# Altium schematic sheet CE842170047_SHEET3.SchDoc
size Tabloid; SheetNumber: 4; SheetTotal: 4; PageSetup: Record=PageOptions|CenterHorizontal=True|CenterVertical=True|PrintScale=0.70|XCorrection=1.00|YCorrection=1.00|PrintKind=1|BorderSize=5000000|LeftOffset=0|BottomOffset=0|Orientation=2|PaperLength=1000|PaperWidth=1000|Scale=100|PaperSource=7|PrintQuality=-4|MediaType=1|DitherType=10|PaperKind=8 1/2x11|PrintScaleMode=1; SPICEModelCacheMIYJXAQF: <root> / <DocumentId>MIYJXAQF</DocumentId> / </root>
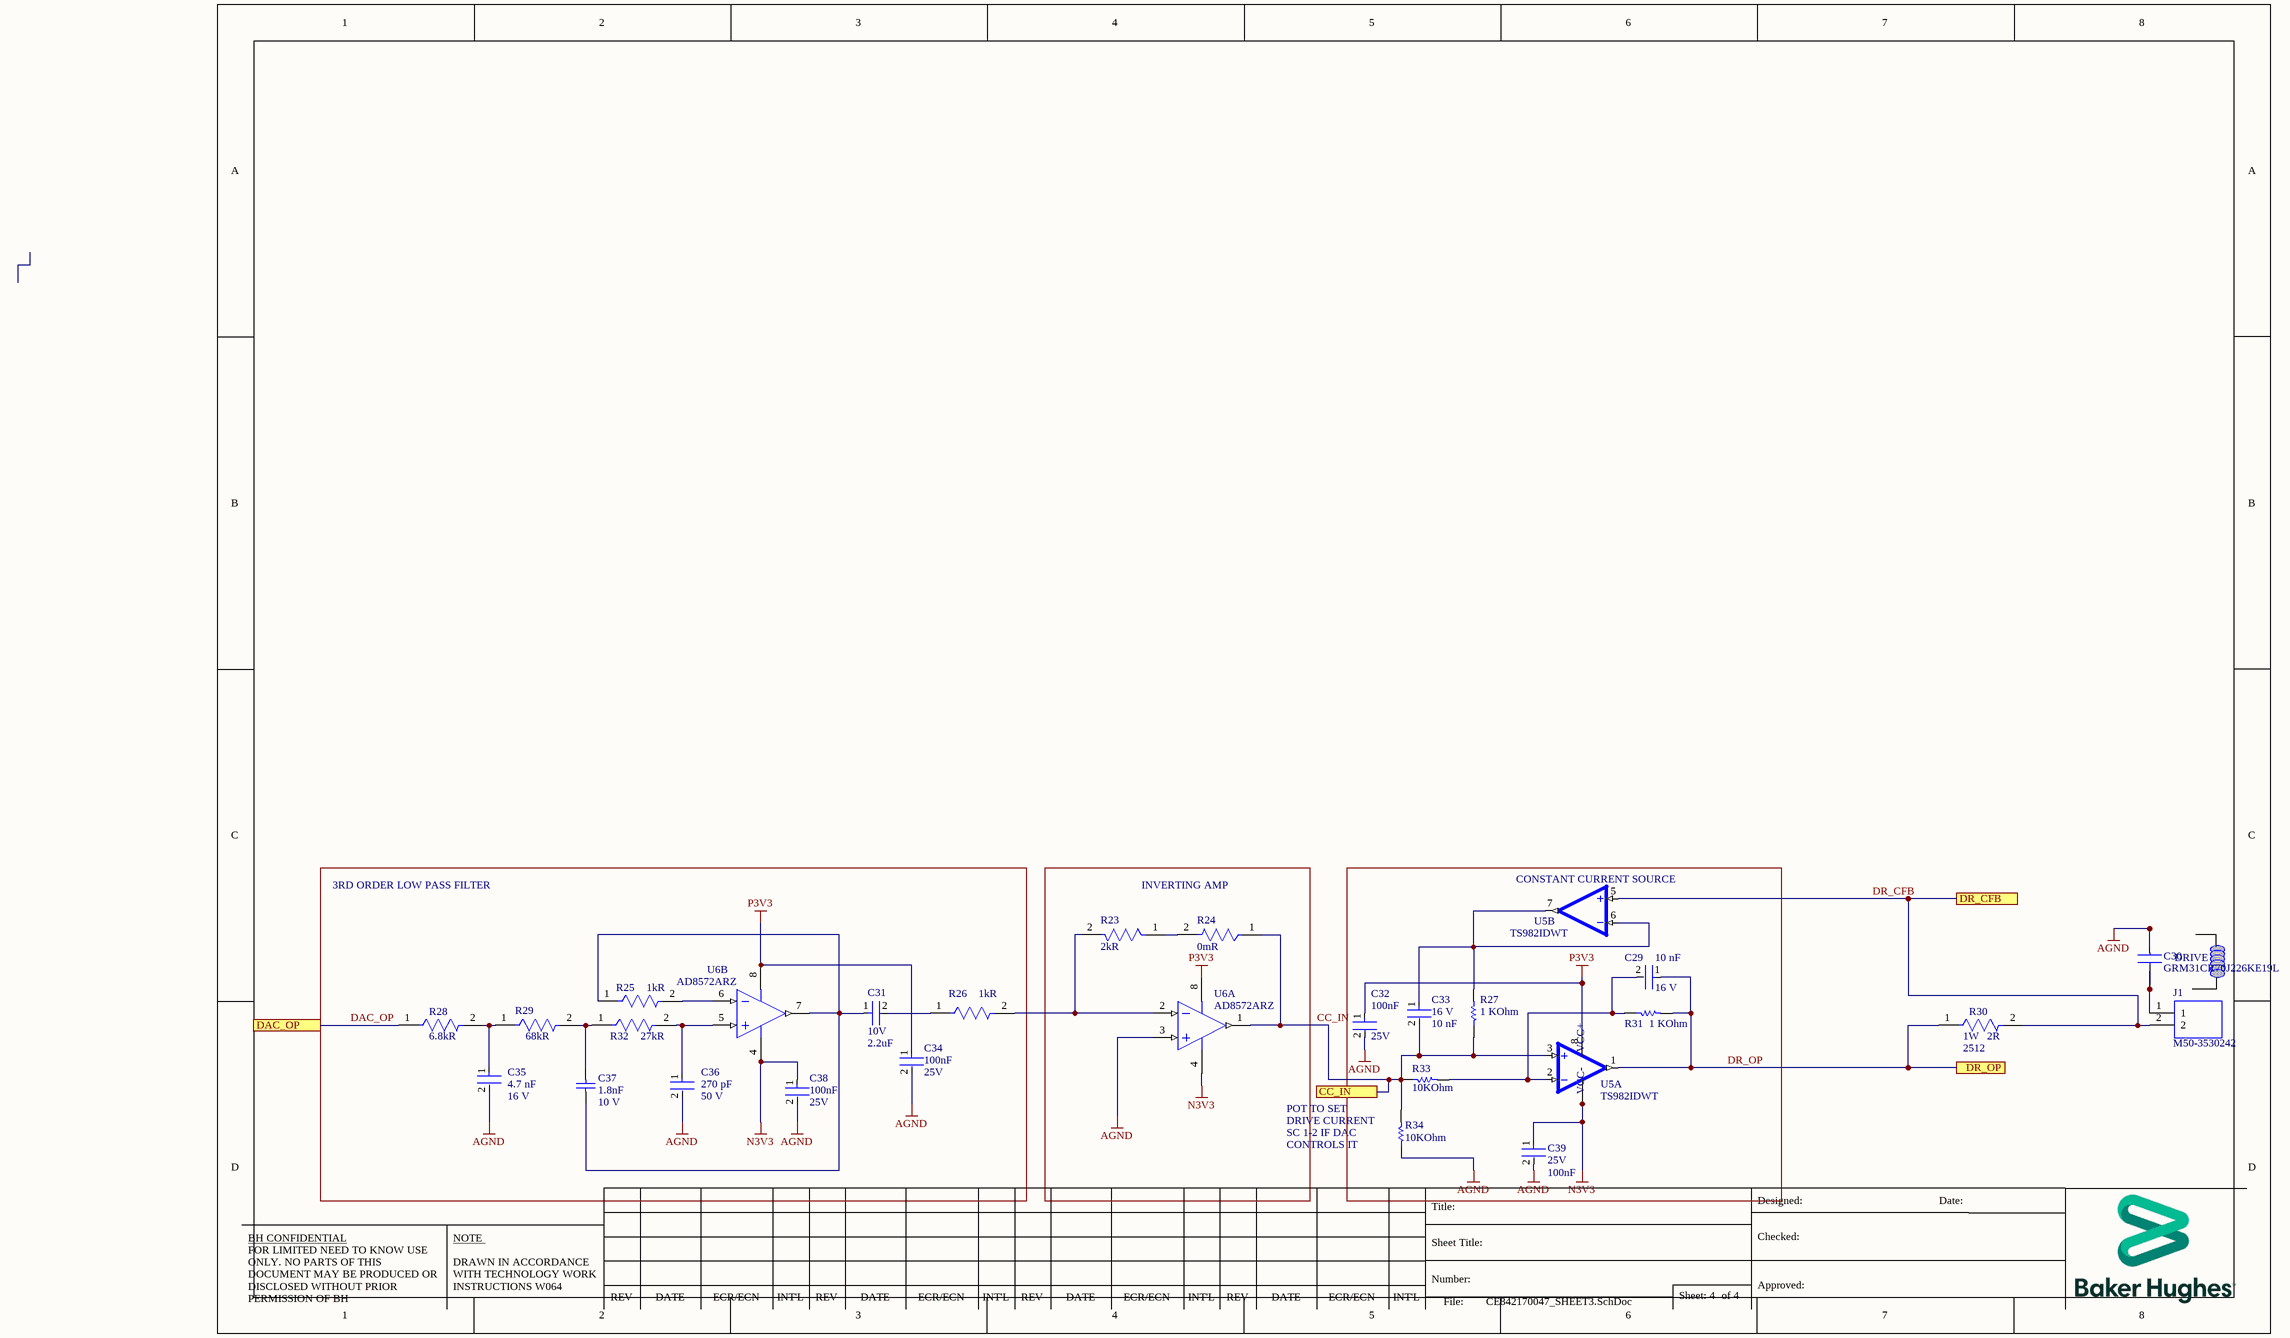
[diagram p0: CE842170047_SHEET3.SchDoc]

## Parts
C29  Capacitance: 10 nF  Voltage Rating: 16 V  [FP-CC0402-MFG]  (hidden comment: CC0402KRX7R7BB103)
C30  GRM31CR70J226KE19L  [CAPC3216X180N]
C31  Voltage Rating: 10V  Capacitance: 2.2uF  [FP-CGB3B-IPC_A]  (hidden comment: CGB3B3X5R1A225M055AB)
C32  Voltage Rating (DC): 25V  Capacitance: 100nF  [FP-C1005-050-0_05-MFG]  (hidden comment: C1005X5R1E104K050BC)
C33  Capacitance: 10 nF  Voltage Rating: 16 V  [FP-CC0402-MFG]  (hidden comment: CC0402KRX7R7BB103)
C34  Voltage Rating (DC): 25V  Capacitance: 100nF  [FP-C1005-050-0_05-MFG]  (hidden comment: C1005X5R1E104K050BC)
C35  Capacitance: 4.7 nF  Voltage Rating: 16 V  [FP-CC0402-MFG]  (hidden comment: CC0402KRX7R7BB472)
C36  Capacitance: 270 pF  Voltage Rating: 50 V  [FP-C0402-BB-MFG]  (hidden comment: C0402C271K5RACTU)
C37  value 1.8nF  Rated Voltage: 10 V  [CAPC0402(1005)60_N]  (hidden comment: CAP 1.8nF 10V 0402(1005))
C38  Voltage Rating (DC): 25V  Capacitance: 100nF  [FP-C1005-050-0_05-MFG]  (hidden comment: C1005X5R1E104K050BC)
C39  Voltage Rating (DC): 25V  Capacitance: 100nF  [FP-C1005-050-0_05-MFG]  (hidden comment: C1005X5R1E104K050BC)
J1  M50-3530242  [HDRV2W40P0X127_1X2_254X210X420P]
R23  Resistance: 2kR  [FP-CRCW0402-e3-IPC_C]  (hidden comment: CRCW04022K00FKED)
R24  Resistance: 0mR  [FP-MCS0402-MFG]  (hidden comment: MCS04020Z0000ZE000)
R25  Resistance: 1kR  [FP-CRCW0402-e3-MFG]  (hidden comment: CRCW04021K00FKED)
R26  Resistance: 1kR  [FP-CRCW0402-e3-MFG]  (hidden comment: CRCW04021K00FKED)
R27  Resistance: 1 KOhm  [RESC1005X40X25NL05T05]  (hidden comment: ERJ-2RKF1001X)
R28  Resistance: 6.8kR  [FP-ERJ2RK-IPC_B]  (hidden comment: ERJ-2RKF6801X)
R29  Resistance: 68kR  [FP-CRCW0402-e3-IPC_C]  (hidden comment: CRCW040268K0JNED)
R30  Case Code (Imperial): 2512  Resistance: 2R  Power Rating: 1W  [FP-CRCW2512-e3-IPC_A]  (hidden comment: CRCW25122R00FNEG)
R31  Resistance: 1 KOhm  [RESC1005X40X25NL05T05]  (hidden comment: ERJ-2RKF1001X)
R32  Resistance: 27kR  [FP-CRCW0402-e3-IPC_C]  (hidden comment: CRCW040227K0JNED)
R33  Resistance: 10KOhm  [RESC1005X40X25LL05T05]  (hidden comment: ERJ2RKF1002X)
R34  Resistance: 10KOhm  [RESC1005X40X25LL05T05]  (hidden comment: ERJ2RKF1002X)
U5  TS982IDWT  [SOIC127P600X175-9N]  (parts A,B of 2)
U6  AD8572ARZ  [ADI-R-8_M]  (parts A,B of 2)

## Blocks framed on the sheet
3RD ORDER LOW PASS FILTER: C31 C34-C38 R25 R26 R28 R29 R32 U6
CONSTANT CURRENT SOURCE: C29 C32 C33 C39 R27 R31 R33 R34 U5

## Ports
CC_IN, DAC_OP, DR_CFB, DR_OP

## Nets
AGND: C30.2 C32.2 C34.2 C35.2 C36.2 C38.2 C39.2 R34.1 U6.3(+IN_A)
N3V3: C38.1 C39.1 U5.4(VCC-) U5.9(VCC-) U6.4(-V)
P3V3: C32.1 C34.1 U5.8(VCC+) U6.8(+V)
CC_IN: C33.2 R24.1 R27.1 R33.1 R34.2 U5.3(NON_INVERTING_INPUT_1) U6.1(OUT_A) ; port CC_IN
DAC_OP: R28.1 ; port DAC_OP
DR_CFB: J1.2 R30.2 U5.5(NON_INVERTING_INPUT_2) ; port DR_CFB
DR_OP: C29.1 R30.1 R31.2 U5.1(OUTPUT1) ; port DR_OP
NetC29_2: C29.2 R31.1 R33.2 U5.2(INVERTING_INPUT_1)
NetC30_1: C30.1 J1.1
NetC31_1: C31.1 C37.1 R25.1 U6.7(OUT_B)
NetC31_2: C31.2 R26.1
NetC33_1: C33.1 R27.2 U5.6(INVERTING_INPUT_2) U5.7(OUTPUT2)
NetC35_1: C35.1 R28.2 R29.1
NetC36_1: C36.1 R32.2 U6.5(+IN_B)
NetC37_2: C37.2 R29.2 R32.1
NetR23_1: R23.1 R24.2
NetR23_2: R23.2 R26.2 U6.2(-IN_A)
NetR25_2: R25.2 U6.6(-IN_B)

## Notes on the sheet
- (near R23) INVERTING AMP
- (near C30) DRIVE
- POT TO SET
- DRIVE CURRENT
- SC 1-2 IF DAC
- CONTROLS IT
- BH CONFIDENTIAL
- NOTE
- Title:
- Sheet Title:
- Designed:
- Checked:
- Date:
- DRAWN IN ACCORDANCE WITH TECHNOLOGY WORK INSTRUCTIONS W064
- REV
- DATE
- ECR/ECN
- INT'L
- Number:
- Approved:
- FOR LIMITED NEED TO KNOW USE ONLY. NO PARTS OF THIS DOCUMENT MAY BE PRODUCED OR DISCLOSED WITHOUT PRIOR PERMISSION OF BH
- File:
- Sheet:
- of

## Library data of the parts
C29 C33 = CMP-03422-000501-1: CAP CER 10000PF 16V X7R 0402; Manufacturer: YAGEO; Automotive Grade: NA; Material: Ceramic; Value: 10 nF; Tolerance: 0.1; Temperature Coefficient: 30ppm/°C; Temperature Range Low: -55°C; Temperature Range High: +125°C; Mouser Description: 0402 10 nF 16 V ±10 % Tolerance X7R SMT Multilayer Ceramic Capacitor; Footprint Url: http://www.yageo.com/exep/pages/download/literatures/UPY-C_GEN_24.pdf; Category: Cap; RoHS: TRUE; Manufacturer Part Number: CC0402KRX7R7BB103; ComponentLink2Description: Datasheet; Ipc Land Pattern Name: CAPC10050X50; Automotive: No; ComponentLink2URL: http://www.yageo.com/documents/recent/UPY-GP_NP0_16V-to-50V_16.pdf; Device Class L1: Passive Components; Height: 0.55mm; Temperature Characteristic: X7R; Package: CC0402; Device Class L3: Ceramic Capacitors; Lead Free: Yes; Device Class L2: Capacitors; Digikey Description: CAP CER 10000PF 16V X7R 0402; Octopart: https://octopart.com/cc0402krx7r7bb103-yageo-192895; Temperature: -55°C to +125°C
C30 = GRM31CR70J226KE19L: Murata 1206 GRM 22uF Ceramic Multilayer Capacitor, 6.3 V dc, +125C, X7R Dielectric, +/-10% SMD; Manufacturer_Name: Murata Electronics; Geometry.Height: 1.8mm; Manufacturer_Part_Number: GRM31CR70J226KE19L; Mouser Part Number: 81-GRM31CR70J226KE9L; Mouser Price/Stock: https://www.mouser.co.uk/ProductDetail/Murata-Electronics/GRM31CR70J226KE19L?qs=WYkmdVEdyYbKPyWIkgMm5A%3D%3D; Arrow Part Number: GRM31CR70J226KE19L; Arrow Price/Stock: https://www.arrow.com/en/products/grm31cr70j226ke19l/murata-manufacturing?region=nac; Mouser Testing Part Number: *; Mouser Testing Price/Stock: *; Datasheet Link: https://datasheet.datasheetarchive.com/originals/distributors/Datasheets_SAMA/ec4f1577dddcc7a13ddad897a28002d3.pdf
C31 = CMP-08246-006382-1: Multilayer Ceramic Capacitors 2.2uF ±20% 10V X5R SMD 0603; Max Operating Temperature: 85°C; Length: 1.6mm; Case Code (Imperial): 0603; Termination: SMD/SMT; Weight: 7.1E-05oz; Mount: Surface Mount; Depth: 0.8mm; Packaging: Tape and Reel; RoHS Compliant: Yes; Series: CGB; Voltage Rating (DC): 10V; Dielectric: X5R; Case/Package: 0603; Case Code (Metric): 1608; Height: 0.55mm; Min Operating Temperature: -55°C; Thickness: 0.022inch; Tolerance: 20%; Width: 0.8mm; Package Quantity: 1; Lead Free: Lead Free
C32 C34 C38 C39 = CMP-2000-06000-2: Multilayer Ceramic Capacitors 100nF ±10% 25V X5R SMD 0402; Case Code (Imperial): 0402; Termination: Wraparound; Series: C; Depth: 0.5mm; Contact Plating: Tin; Case Code (Metric): 1005; Dielectric: X5R; Case/Package: 0402; Voltage Rating: 25V; Packaging: Tape and Reel; Thickness: 0.022inch; Dielectric Material: Ceramic; Height: 0.5mm; Weight: 2.3E-05oz; RoHS Compliant: Yes; Width: 0.02inch; Tolerance: 10%; Mount: Surface Mount; Package Quantity: 1; Max Operating Temperature: 85°C; Construction: Flat; Min Operating Temperature: -55°C; REACH SVHC: No SVHC; Resistor Type: Ceramic; Length: 1mm; Lead Free: Lead Free; Voltage: 25V
C35 = CMP-1034-01810-2: CAP CER 4700PF 16V X7R 0402; Manufacturer: YAGEO; Automotive Grade: NA; Material: Ceramic; Value: 4.7 nF; Tolerance: 0.1; Temperature Coefficient: 30ppm/°C; Automotive: No; Temperature Range Low: -55°C; Category: Cap; RoHS: TRUE; Footprint Url: http://www.yageo.com/exep/pages/download/literatures/UPY-C_GEN_24.pdf; Device Class L2: Capacitors; Octopart: https://octopart.com/cc0402krx7r7bb472-yageo-44648962; Package: CC0402; Temperature Characteristic: X7R; ComponentLink2Description: Datasheet; ComponentLink2URL: http://www.yageo.com/documents/recent/UPY-GP_NP0_16V-to-50V_16.pdf; Mouser Description: YAGEO (PHYCOMP) - CC0402KRX7R7BB472 - CAP, MLCC, X7R, 4.7NF, 16V, 0402; Device Class L1: Passive Components; Ipc Land Pattern Name: CAPC10050X50; Height: 0.55mm; Device Class L3: Ceramic Capacitors; Manufacturer Part Number: CC0402KRX7R7BB472; Temperature: -55°C to +125°C; Temperature Range High: +125°C; Lead Free: Yes; Digikey Description: CAP CER 4700PF 16V X7R 0402
C36 = CMP-2008-02191-3: CAP CER 270PF 50V 10% X7R 0402; Manufacturer: Kemet; Temperature Coefficient: 15%; Tolerance: 0.1; Material: Ceramic; Device Class L2: Capacitors; Digikey Description: CAP CER 270PF 50V 10% X7R 0402; ComponentLink2Description: Datasheet; Temperature: -55°C to +125°C; Value: 270 pF; Manufacturer Part Number: C0402C271K5RACTU; RoHS: TRUE; Automotive: No; Mouser Description: Multilayer Ceramic Capacitors MLCC - SMD/SMT 50volts 270pF X7R 10%; Category: Cap; Lead Free: Yes; Package: C0402-BB; Device Class L3: Ceramic Capacitors; Octopart: https://octopart.com/c0402c271k5ractu-kemet-5510096; Ipc Land Pattern Name: CAPC10050X50; Device Class L1: Passive Components; Height: 0.55mm; Temperature Characteristic: X7R; Temperature Range High: +125°C; Temperature Range Low: -55°C; ComponentLink2URL: https://content.kemet.com/datasheets/KEM_C1002_X7R_SMD.pdf
C37 = CMP-1034-01698-1: CAP 1.8nF 10V ±5% 0402 (1005 Metric) Thickness 0.6mm SMD; Case-Metric: 1005; Case-EIA: 0402; Tolerance: Â±5%; Max Thickness: 0.6 mm; Technology: SMT
J1 = M50-3530242: Headers & Wire Housings 2 WAY SIL VERT PC TAIL P/HDR; Manufacturer_Name: Harwin; Geometry.Height: 4.2mm; Mouser Part Number: 855-M50-3530242; Mouser Price/Stock: https://www.mouser.co.uk/ProductDetail/Harwin/M50-3530242?qs=%252BdQmOuGyFcFfqfwYQe%2FxZw%3D%3D; Manufacturer_Part_Number: M50-3530242; Datasheet Link: https://cdn.harwin.com/pdfs/M50-353.pdf
R23 = CMP-2002-08446-2: RES Thick Film, 2kΩ, 1%, 0.063W, 100ppm/°C, 0402; Max Power Dissipation: 63mW; Voltage Rating: 50V; Contact Plating: Tin; Tolerance: 1%; Weight: 2.3E-05oz; Mount: Surface Mount; Length: 1mm; Case Code (Metric): 1005; Number of Pins: 2; Depth: 0.5mm; Power Rating: 63mW; Packaging: Tape and Reel; Case/Package: 0402; Max Operating Temperature: 155°C; Width: 0.5mm; Package Quantity: 10; Case Code (Imperial): 0402; Features: Automotive AEC-Q200; Number of Terminations: 2; Lead Free: Lead Free; Composition: Thick Film; Termination: SMD/SMT; Min Operating Temperature: -55°C; Radiation Hardening: No; Military Standard: Not; Height: 0.35mm; Voltage Rating (DC): 50V; Temperature Coefficient: 100ppm/°C
R24 = CMP-02407-001042-1: RES SMD 1.2K OHM 1% 1/10W 0402; Voltage Rating: 50V; Max Power Dissipation: 100mW; Composition: Thin Film; Max Operating Temperature: 125°C; Number of Terminations: 2; Mount: Surface Mount; Packaging: Tape and Reel; REACH SVHC: No SVHC; Case Code (Metric): 1005; Package Quantity: 1; Radiation Hardening: No; Termination: Wraparound; Case Code (Imperial): 0402; Contact Plating: Tin; Depth: 0.5mm; Height: 0.015inch; Length: 1mm; Voltage Rating (DC): 50V; Power Rating: 100mW; Lead Free: Lead Free; Min Operating Temperature: -55°C; Military Standard: Not; Width: 0.02inch; Case/Package: 0402
R25 R26 = CMP-2002-08276-2: RES Thick Film, 1kΩ, 1%, 0.063W, 100ppm/°C, 0402; Power Rating: 63mW; Voltage Rating (DC): 50V; Package Quantity: 10; Termination: SMD/SMT; Width: 0.5mm; Military Standard: Not; Length: 1mm; Contact Plating: Tin; Mount: Surface Mount; Packaging: Tape and Reel; Case Code (Imperial): 0402; Tolerance: 1%; Weight: 2.3E-05oz; Number of Pins: 2; Case/Package: 0402; Case Code (Metric): 1005; Lead Free: Lead Free; Number of Terminations: 2; Max Power Dissipation: 63mW; Depth: 0.5mm; Temperature Coefficient: 100ppm/°C; Max Operating Temperature: 155°C; Height: 0.35mm; Features: Automotive AEC-Q200; Composition: Thick Film; Radiation Hardening: No; Voltage Rating: 50V; Min Operating Temperature: -55°C
R27 R31 = CMP-1011-00510-4: Chip Resistor, 1 KOhm, +/- 1%, 100 mW, -55 to 155 degC, 0402 (1005 Metric), RoHS, Tape and Reel; Manufacturer: Basic Passives; Voltage Rating: 50 V; Case\/Package: 0402; Power Rating: 100 mW; PartNumber: ERJ-2RKF1001X; DatasheetVersion: 04/2015; Radiation Hardening: No; Pins: 2; Height: 0.35 mm; RoHSCompliant: true; Case Code (Imperial): 0402; ComponentLink2Description: Datasheet; ComponentLink1Description: Manufacturer URL; PackageReference: 0402; Mount: Surface Mount; Package Quantity: 10000; Tolerance: 1%; ComponentLink1URL: http://www.panasonic.com/; PackageDescription: 2-Pin Surface Mount Device, Body 1 x 0.5 mm; Mounting Technology: Surface Mount; Case Code (Metric): 1005; ComponentLink2URL: http://industrial.panasonic.com/cdbs/www-data/pdf/RDA0000/AOA0000C86.pdf; REACH SVHC: Yes; Packaging: Tape and Reel; Max Operating Temperature: 155 degC; Min Operating Temperature: -55 degC; Width: 0.5 mm; Length: 1 mm
R28 = CMP-1011-00604-3: RES SMD 6.8K OHM 1% 1/10W 0402; Voltage Rating: 50V; Power Rating: 100mW; Temperature Coefficient: 100ppm/°C; Min Operating Temperature: -55°C; Max Operating Temperature: 155°C; Number of Terminations: 2; Max Power Dissipation: 100mW; Military Standard: Not; Package Quantity: 1; Depth: 0.5mm; Contact Plating: Tin; Case Code (Imperial): 0402; Number of Pins: 2; Tolerance: 1%; Height: 0.35mm; Case/Package: 0402; Composition: Thick Film; Width: 0.5mm; Packaging: Tape and Reel; Mount: Surface Mount; Radiation Hardening: No; REACH SVHC: No SVHC; Features: Automotive AEC-Q200; Voltage Rating (DC): 50V; Length: 1mm; Case Code (Metric): 1005; Termination: SMD/SMT; Lead Free: Lead Free
R29 = CMP-2002-00171-2: RES Thick Film, 68kΩ, 5%, 0.063W, 200ppm/°C, 0402; Power Rating: 63mW; Voltage Rating (DC): 50V; Case Code (Imperial): 0402; Max Operating Temperature: 155°C; Case Code (Metric): 1005; Contact Plating: Tin; Composition: Thick Film; Radiation Hardening: No; Case/Package: 0402; Height: 0.016inch; Weight: 2.3E-05oz; Termination: SMD/SMT; Tolerance: 5%; Package Quantity: 1; Temperature Coefficient: 200ppm/°C; Lead Free: Lead Free; Features: Automotive AEC-Q200; Min Operating Temperature: -55°C; Number of Terminations: 2; Depth: 0.5mm; Packaging: Tape and Reel; Voltage Rating: 50V; Width: 0.5mm; Military Standard: Not; Length: 1mm; Number of Pins: 2; Max Power Dissipation: 63mW
R30 = CMP-02407-003108-1: RES Thick Film, 2Ω, 1%, 1W, 200ppm/°C, 2512; Voltage Rating: 500V; Temperature Coefficient: 73ppm/°C; Max Operating Temperature: 155°C; Case Code (Metric): 6432; Termination: SMD/SMT; Length: 6.3mm; Width: 3.15mm; Voltage Rating (DC): 500V; Packaging: Tape and Reel; Depth: 3.15mm; Weight: 0.001429oz; Lead Free: Lead Free; Composition: Thick Film; Min Operating Temperature: -55°C; Package Quantity: 2000; Number of Pins: 2; Height: 0.6mm; Tolerance: 1%; Case/Package: 2512
R32 = CMP-1011-00108-3: RES Thick Film, 27kΩ, 5%, 0.063W, 200ppm/°C, 0402; Voltage Rating: 50V; Max Power Dissipation: 63mW; Packaging: Tape and Reel; Case/Package: 0402; Width: 0.5mm; Min Operating Temperature: -55°C; Number of Terminations: 2; Military Standard: Not; Radiation Hardening: No; Mount: Surface Mount; Voltage Rating (DC): 50V; Weight: 2.3E-05oz; Package Quantity: 1; Tolerance: 5%; Height: 0.016inch; Contact Plating: Tin; Temperature Coefficient: 200ppm/°C; Termination: SMD/SMT; Max Operating Temperature: 155°C; Power Rating: 63mW; Features: Automotive AEC-Q200; Lead Free: Lead Free; Case Code (Imperial): 0402; Composition: Thick Film; Length: 1mm; Case Code (Metric): 1005; Number of Pins: 2; Depth: 0.5mm
R33 R34 = CMP-2000-07588-1: Chip Resistor, 10 KOhm, +/- 1%, 0.1 W, -55 to 155 degC, 0402 (1005 Metric), RoHS, Tape and Reel; Manufacturer: Panasonic; Power Rating: 100mW; Voltage Rating: 50V; Case\/Package: 0402; Temperature Coefficient: 100ppm\/degreesC; RoHSCompliant: True; Lead Free: LeadFree; Package Quantity: 1; Contact Plating: Tin; Length: 1mm; Radiation Hardening: No; REACH SVHC: NoSVHC; Max Operating Temperature: 155degC; Depth: 0.5mm; Case Code (Imperial): 0402; Military Standard: Not; Package Description: 2-Pin Surface Mount Device, Body 1 x 0.5 mm; Termination: SMD/SMT; Case Code (Metric): 1005; Height: 0.35mm; Packaging: TapeandReel; Voltage Rating (DC): 50V; Package Reference: 402; Number of Pins: 2; Tolerance: 1%; Mounting Technology: SurfaceMount; Width: 0.02inch; Mount: SurfaceMount; Datasheet URL: https://industrial.panasonic.com/cdbs/www-data/pdf/RDA0000/AOA0000C304.pdf; Composition: ThickFilm; Datasheet Version: 02/2017; Manufacturer URL: http://www.panasonic.com/; Max Power Dissipation: 100mW; Number of Terminations: 2; Min Operating Temperature: -55degC
U6 = CMP-0384-00919-1: Double Channel Rail-to-Rail Operational Amplifier, 1.5 MHz BW, 400 mV/us SR, Industrial, 8-pin SOIC (R-8), Tube; Manufacturer: Analog Devices; Generic Part Number: AD8572; Amplifiers Per Package: 2; Iq/Amp: 975uA; Input Offset Voltage: 1uV; Small Signal Bandwidth: 1.5MHz; Input Bias Current: 10pA; V Span Min: 2.7V; V Span Max: 6V; PackageVersion: 060506-A; ComponentLink1Description: Manufacturer URL; Code_JEDEC: MS-012-AA; PackageReference: R-8; ComponentLink1URL: http://www.analog.com/en/index.html; Mounting Technology: Surface Mount; ComponentLink2Description: Datasheet; Slew Rate: 400mV/us; ComponentLink3Description: Package Specification; DatasheetVersion: Rev. E; ComponentLink2URL: http://www.analog.com/static/imported-files/data_sheets/AD8571_8572_8574.pdf; PartNumber: AD8572ARZ; PackageDescription: 8-Pin Standard Small Outline Package, Body 3.9 x 4.9 mm, Pitch 1.27 mm; ComponentLink3URL: http://www.analog.com/static/imported-files/packages/PKG_PDF/SOIC_Narrow%20(R)/R_8.pdf
U5 = TS982IDWT: Package: None; Price: None; Value: *; MP: TS982IDWT; Availability: Unavailable